# Altium schematic sheet 高压开关电源.SchDoc
size A3
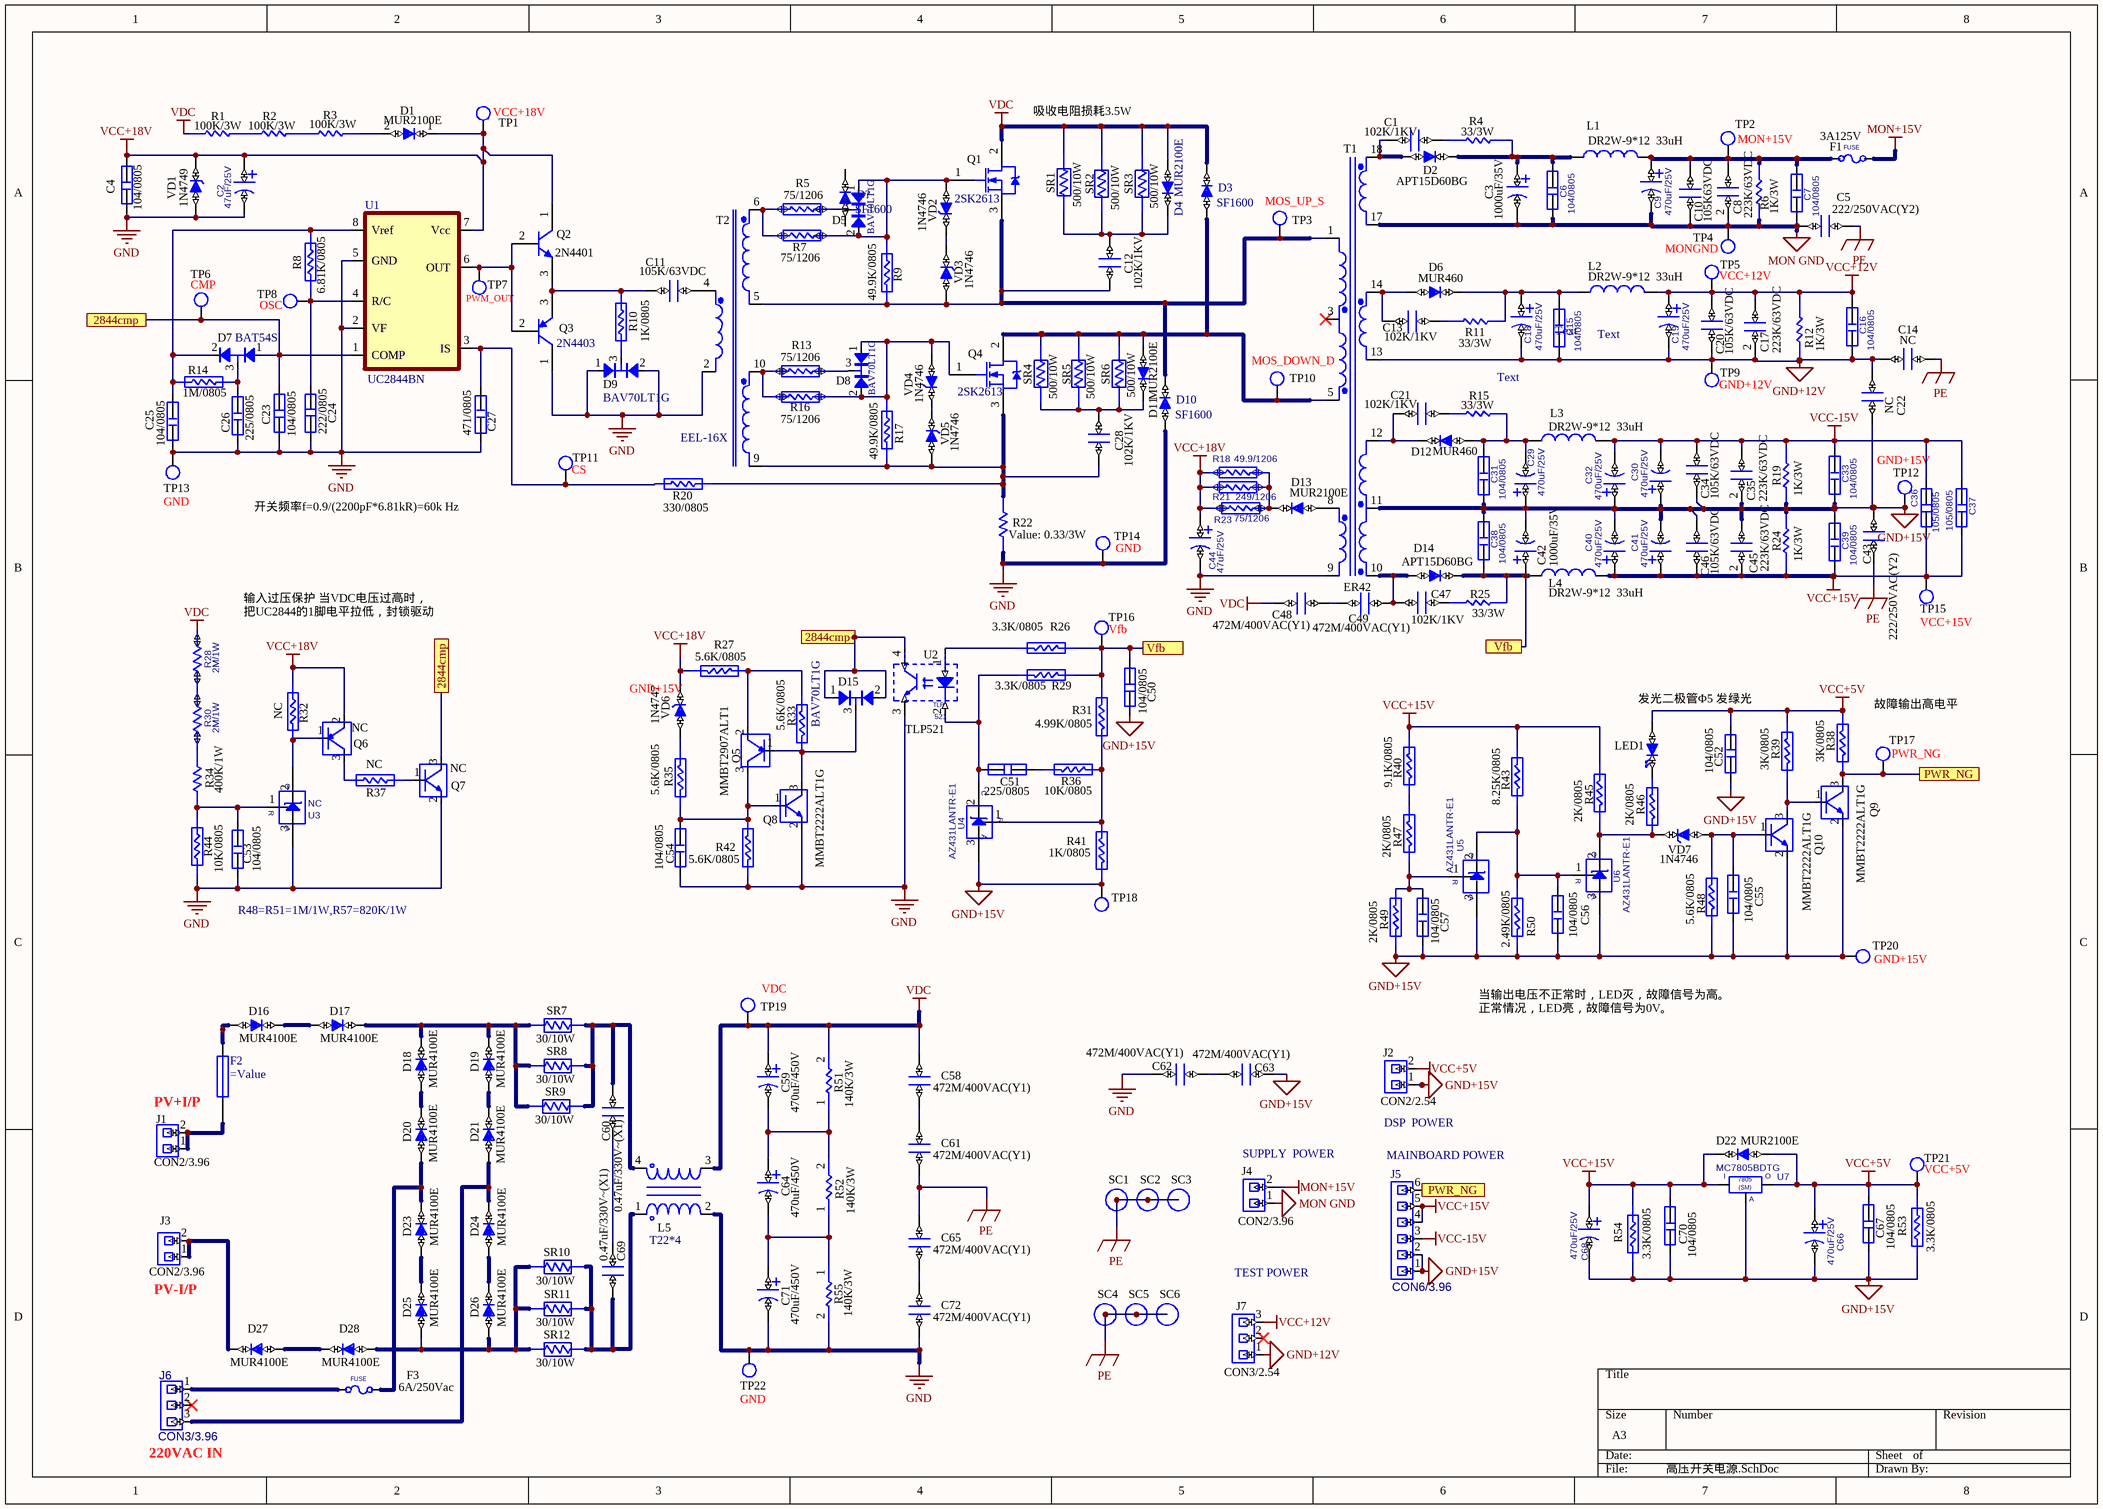
[diagram p0: 高压开关电源.SchDoc]

## Parts
C1  102K/1KV  [CC509*5]
C2  47uF/25V  [CE2050]
C3  1000uF/35V  [CE50130]
C4  104/0805  [C0805BSM]
C5  222/250VAC(Y2)  [C10013*4]
C6  104/0805  [C0805BSM]
C7  104/0805  [C0805BSM]
C8  223K/63VDC  [C508*3]
C9  470uF/25V  [CE3580]
C10  105K63VDC  [C508*5]
C11  105K/63VDC  [C508*5]
C12  102K/1KV  [CC509*5]
C13  102K/1KV  [CC509*5]
C14  NC  [C10013*4]
C15  104/0805  [C0805BSM]
C16  104/0805  [C0805BSM]
C17  223K/63VDC  [C508*3]
C18  470uF/25V  [CE3580]
C19  470uF/25V  [CE3580]
C20  105K/63VDC  [C508*5]
C21  102K/1KV  [CC509*5]
C22  NC  [C10013*4]
C23  104/0805  [C0805BSM]
C24  222/0805  [C0805BSM]
C25  104/0805  [C0805BSM]
C26  225/0805  [C0805BSM]
C27  471/0805  [C0805BSM]
C28  102K/1KV  [CC509*5]
C29  470uF/25V  [CE3580]
C30  470uF/25V  [CE3580]
C31  104/0805  [C0805BSM]
C32  470uF/25V  [CE3580]
C33  104/0805  [C0805BSM]
C34  105K/63VDC  [C508*5]
C35  223K/63VDC  [C508*3]
C36  105/0805  [C0805BSM]
C37  105/0805  [C0805BSM]
C38  104/0805  [C0805BSM]
C39  104/0805  [C0805BSM]
C40  470uF/25V  [CE3580]
C41  470uF/25V  [CE3580]
C42  1000uF/35V  [CE50130]
C43  222/250VAC(Y2)  [C10013*4]
C44  47uF/25V  [CE2050]
C45  223K/63VDC  [C508*3]
C46  105K/63VDC  [C508*5]
C47  102K/1KV  [CC509*5]
C48  472M/400VAC(Y1)  [C10013*5]
C49  472M/400VAC(Y1)  [C10013*5]
C50  104/0805  [C0805BSM]
C51  225/0805  [C0805BSM]
C52  104/0805  [C0805BSM]
C53  104/0805  [C0805BSM]
C54  104/0805  [C0805BSM]
C55  104/0805  [C0805BSM]
C56  104/0805  [C0805BSM]
C57  104/0805  [C0805BSM]
C58  472M/400VAC(Y1)  [C10013*5]
C59  470uF/450V  [CE100350]
C60  0.47uF/330V~(X1)  [C22527*9]
C61  472M/400VAC(Y1)  [C10013*5]
C62  472M/400VAC(Y1)  [C10013*5]
C63  472M/400VAC(Y1)  [C10013*5]
C64  470uF/450V  [CE100350]
C65  472M/400VAC(Y1)  [C10013*5]
C66  470uF/25V  [CE3580]
C67  104/0805  [C0805BSM]
C68  470uF/25V  [CE3580]
C69  0.47uF/330V~(X1)  [C22527*9]
C70  104/0805  [C0805BSM]
C71  470uF/450V  [CE100350]
C72  472M/400VAC(Y1)  [C10013*5]
D1  MUR2100E  [D41P2H-1]
D2  APT15D60BG  [D247P2]
D3  SF1600  [D4236P2]
D4  MUR2100E  [D4236P2]
D5  BAV70LT1G  [TRNPNBSM]
D6  MUR460  [D27P2H-1]
D7  BAT54S  [TRNPNBSM]
D8  BAV70LT1G  [TRNPNBSM]
D9  BAV70LT1G  [TRNPNBSM]
D10  SF1600  [D4236P2]
D11  MUR2100E  [D4236P2]
D12  MUR460  [D27P2H-1]
D13  MUR2100E  [D41P2H-1]
D14  APT15D60BG  [D247P2]
D15  BAV70LT1G  [TRNPNBSM]
D16  MUR4100E  [D150]
D17  MUR4100E  [D150]
D18  MUR4100E  [D150]
D19  MUR4100E  [D150]
D20  MUR4100E  [D150]
D21  MUR4100E  [D150]
D22  MUR2100E  [D41P2H-1]
D23  MUR4100E  [D150]
D24  MUR4100E  [D150]
D25  MUR4100E  [D150]
D26  MUR4100E  [D150]
D27  MUR4100E  [D150]
D28  MUR4100E  [D150]
D?  SF1600  [D4236P2]
F1  3A125V  [Fuse 3A 125V]
F2  (no value)  [F3A1000VP4]
F3  6A/250Vac  [FUSE5A350VAC]
J1  CON2/3.96  [SIP-B1P2H]
J2  CON2/2.54  [SIP-B1P2]
J3  CON2/3.96  [SIP-B1P2H]
J4  CON2/3.96  [SIP-B1P2H]
J5  CON6/3.96  [SIP-B1P6H]
J6  CON3/3.96  [SIP-B1P3H]
J7  CON3/2.54  [SIP-C3P3H]
L1  DR2W-9*12  33uH  [L9P2]
L2  DR2W-9*12  33uH  [L9P2]
L3  DR2W-9*12  33uH  [L9P2]
L4  DR2W-9*12  33uH  [L9P2]
L5  T22*4  [L28*17.5P4]
LED1  发光二极管Φ5 发绿光  [LED25C]
Q1  2SK2613  [2SK2613]
Q2  2N4401  [2N4401]
Q3  2N4403  [2N4403]
Q4  2SK2613  [2SK2613]
Q5  MMBT2907ALT1  [TRPNPBSM]
Q6  NC  [TRPNPBSM]
Q7  NC  [TRNPNBSM]
Q8  MMBT2222ALT1G  [TRNPNBSM]
Q9  MMBT2222ALT1G  [TRNPNBSM]
Q10  MMBT2222ALT1G  [TRNPNBSM]
R1  100K/3W  [R100060]
R2  100K/3W  [R100060]
R3  100K/3W  [R100060]
R4  33/3W  [R100060]
R5  75/1206  [R1206NSM]
R6  1K/3W  [R100060]
R7  75/1206  [R1206NSM]
R8  6.81K/0805  [R0805BSM]
R9  49.9K/0805  [R0805BSM]
R10  1K/0805  [R0805BSM]
R11  33/3W  [R100060]
R12  1K/3W  [R100060]
R13  75/1206  [R1206NSM]
R14  1M/0805  [R0805BSM]
R15  33/3W  [R100060]
R16  75/1206  [R1206NSM]
R17  49.9K/0805  [R0805BSM]
R18  49.9/1206  [R1206NSM]
R19  1K/3W  [R100060]
R20  330/0805  [R0805BSM]
R21  249/1206  [R1206NSM]
R22  0.33/3W  [R075005]
R23  75/1206  [R1206NSM]
R24  1K/3W  [R100060]
R25  33/3W  [R100060]
R26  3.3K/0805  [R0805BSM]
R27  5.6K/0805  [R0805BSM]
R28  2M/1W  [R075005]
R29  3.3K/0805  [R0805BSM]
R30  2M/1W  [R075005]
R31  4.99K/0805  [R0805BSM]
R32  NC  [R0805BSM]
R33  5.6K/0805  [R0805BSM]
R34  400K/1W  [R075005]
R35  5.6K/0805  [R0805BSM]
R36  10K/0805  [R0805BSM]
R37  NC  [R0805BSM]
R38  3K/0805  [R0805BSM]
R39  3K/0805  [R0805BSM]
R40  9.1K/0805  [R0805BSM]
R41  1K/0805  [R0805BSM]
R42  5.6K/0805  [R0805BSM]
R43  8.25K/0805  [R0805BSM]
R44  10K/0805  [R0805BSM]
R45  2K/0805  [R0805BSM]
R46  2K/0805  [R0805BSM]
R47  2K/0805  [R0805BSM]
R48  5.6K/0805  [R0805BSM]
R49  2K/0805  [R0805BSM]
R50  2.49K/0805  [R0805BSM]
R51  140K/3W  [R100060]
R52  140K/3W  [R100060]
R53  3.3K/0805  [R0805BSM]
R54  3.3K/0805  [R0805BSM]
R55  140K/3W  [R100060]
SC1  *  [SC40]  (value not drawn)
SC2  *  [SC40]  (value not drawn)
SC3  *  [SC40]  (value not drawn)
SC4  *  [SC40]  (value not drawn)
SC5  *  [SC40]  (value not drawn)
SC6  *  [SC40]  (value not drawn)
SR1  500/10W  [SRSQM1411]
SR2  500/10W  [SRSQM1411]
SR3  500/10W  [SRSQM1411]
SR4  500/10W  [SRSQM1411]
SR5  500/10W  [SRSQM1411]
SR6  500/10W  [SRSQM1411]
SR7  30/10W  [SRSQM130100]
SR8  30/10W  [SRSQM130100]
SR9  30/10W  [SRSQM130100]
SR10  30/10W  [SRSQM130100]
SR11  30/10W  [SRSQM130100]
SR12  30/10W  [SRSQM130100]
T1  ER42  [ER42]
T2  EEL-16X  [EEL-16X]
TP1  VCC+18V  [TEST]
TP2  MON+15V  [TEST]
TP3  MOS_UP_S  [TEST]
TP4  MONGND  [TEST]
TP5  VCC+12V  [TEST]
TP6  CMP  [TEST]
TP7  PWM_OUT  [TEST]
TP8  OSC  [TEST]
TP9  GND+12V  [TEST]
TP10  MOS_DOWN_D  [TEST]
TP11  CS  [TEST]
TP12  GND+15V  [TEST]
TP13  GND  [TEST]
TP14  GND  [TEST]
TP15  VCC+15V  [TEST]
TP16  Vfb  [TEST]
TP17  PWR_NG  [TEST]
TP18  GND+15V  [TEST]
TP19  VDC  [TEST]
TP20  GND+15V  [TEST]
TP21  VCC+5V  [TEST]
TP22  GND  [TEST]
U1  UC2844BN  [2844]
U2  TLP521  [PH521]
U3  NC  [AZ431LS23TSM]
U4  AZ431LANTR-E1  [AZ431LS23TSM]
U5  AZ431LANTR-E1  [AZ431LS23TSM]
U6  AZ431LANTR-E1  [AZ431LS23TSM]
U7  MC7805BDTG  [7805SM]
VD1  1N4749  [D41P2H-1]
VD2  1N4746  [D41P2H-1]
VD3  1N4746  [D41P2H-1]
VD4  1N4746  [D41P2H-1]
VD5  1N4746  [D41P2H-1]
VD6  1N4747  [D41P2H-1]
VD7  1N4746  [D41P2H-1]

## Ports
2844cmp, PWR_NG, Vfb

## Nets
GND: C2.2 C4.1 C23.1 C24.2 C25.1 C26.1 C27.2 C44.2 C53.1 C54.1 C62.1 C71.2 C72.2 D9.1(A1) D9.2(A2) D10.2 L5.2 Q3.1(C) Q7.2 Q8.2 R22.2 R42.2 R44.2 R55.2 T1.9 T2.2(Pri-) TP13.1 TP14.1 TP22.1 U1.2(VF) U1.5(GND) U2.3 U3.3 VD1.2
GND+12V: C14.1 C15.1 C16.1 C17.2 C18.2 C19.2 C20.2 C22.1 J7.1 R12.1 T1.13 TP9.1
GND+15V: C22.2 C29.1 C30.1 C31.1 C32.1 C33.1 C34.2 C35.2 C38.2 C39.2 C40.2 C41.2 C42.2 C43.2 C45.1 C46.1 C50.1 C52.2 C55.1 C56.1 C57.1 C63.2 C66.2 C67.1 C68.2 C70.1 J2.1 J5.1 J5.2 Q9.2 Q10.2 R19.1 R24.2 R41.2 R48.2 R49.2 R50.2 R53.2 R54.2 T1.11 TP12.1 TP18.1 TP20.1 U4.3 U5.3 U6.3 U7.2(GND)
MON GND: C3.2 C5.1 C6.1 C7.1 C8.2 C9.2 C10.2 J4.1 R6.1 T1.17 TP4.1
MON+15V: F1.2 J4.2
PE: C5.2 C14.2 C43.1 C61.2 C65.1 SC1.1 SC2.1 SC3.1 SC4.1 SC5.1 SC6.1
VCC+5V: C52.1 C66.1 C67.2 D22.2 J2.2 LED1.2 R38.1 R39.1 R53.1 TP21.1 U7.3
VCC+12V: C16.2 C17.1 C19.1 C20.1 J7.3 L2.2 R12.2 TP5.1
VCC+15V: C36.1 C37.1 C39.1 C40.1 C41.1 C45.2 C46.2 C68.1 C70.2 D22.1 J5.4 J5.5 L4.2 R24.1 R40.1 R43.1 R45.1 R54.1 TP15.1 U7.1
VCC+18V: C2.1 C4.2 C44.1 D1.1 Q2.1(C) Q6.2 R18.1 R21.1 R23.1 R27.2 R32.1 TP1.1 U1.7(Vcc) VD1.1 VD6.1
VCC-15V: C30.2 C32.2 C33.2 C34.1 C35.1 C36.2 C37.2 J5.3 L3.2 R19.2
VDC: C48.1 C58.1 C59.1 D3.1 D4.2 L5.3 Q1.2(D) R1.1 R28.1 R51.2 SR1.2 SR2.2 SR3.2 TP19.1
2844cmp: C23.2 D7.1(A2) D15.1(A1) D15.2(A2) Q7.3 TP6.1 U1.1(COMP) U2.4 ; port 2844cmp
PWR_NG: J5.6 Q9.3 R38.2 TP17.1 ; port PWR_NG
Vfb: C38.1 C42.1 C50.2 D14.1 L4.1 R25.1 R26.1 R29.1 R31.1 TP16.1 ; port Vfb
NetC1_1: C1.1 D2.2 T1.18
NetC1_2: C1.2 R4.1
NetC3_1: C3.1 C6.2 D2.1 L1.1 R4.2
NetC7_2: C7.2 C8.1 C9.1 C10.1 F1.1 L1.2 R6.2 TP2.1
NetC11_1: C11.1 T2.4(Pri+)
NetC11_2: C11.2 Q2.3(E) Q3.3(E) R10.1
NetC12_1: C12.1 D10.1 Q1.3(S) R9.2 T1.1 T2.5 TP3.1 VD3.2
NetC12_2: C12.2 D4.1 SR1.1 SR2.1 SR3.1
NetC13_1: C13.1 D6.2 T1.14
NetC13_2: C13.2 R11.1
NetC15_2: C15.2 C18.1 D6.1 L2.1 R11.2
NetC21_1: C21.1 D12.1 T1.12
NetC21_2: C21.2 R15.2
NetC24_1: C24.1 R8.2 TP8.1 U1.4(R/C)
NetC25_2: C25.2 D7.2(A1) R8.1 R14.2 U1.8(Vref)
NetC26_2: C26.2 D7.3(K) R14.1
NetC27_1: C27.1 R20.1 TP11.1 U1.3(IS)
NetC28_1: C28.1 Q4.3(S) R17.2 R20.2 R22.1 T2.9 VD5.2
NetC28_2: C28.2 D11.1 SR4.1 SR5.1 SR6.1
NetC29_2: C29.2 C31.2 D12.2 L3.1 R15.1
NetC47_1: C47.1 C49.2 D14.2 T1.10
NetC47_2: C47.2 R25.2
NetC48_2: C48.2 C49.1
NetC51_1: C51.1 R36.2
NetC51_2: C51.2 R29.2 U2.2 U4.2
NetC53_2: C53.2 R34.2 R44.1 U3.1
NetC54_2: C54.2 Q5.3 Q8.1 R35.2 R42.1
NetC55_2: C55.2 Q10.1 R48.1 VD7.2
NetC56_2: C56.2 R43.2 R50.1 U5.2 U6.1
NetC57_2: C57.2 R47.2 R49.1 U5.1
NetC58_2: C58.2 C61.1
NetC59_2: C59.2 C64.1 R51.1 R52.2
NetC60_1: C60.1 L5.4 SR7.2 SR8.2 SR9.2
NetC60_2: C60.2 C69.1
NetC62_2: C62.2 C63.1
NetC64_2: C64.2 C71.1 R52.1 R55.1
NetC65_2: C65.2 C72.1
NetC69_2: C69.2 L5.1 SR10.2 SR11.2 SR12.2
NetD1_2: D1.2 R3.2
NetD3_2: D3.2 D11.2 Q4.2(D) SR4.2 SR5.2 SR6.2 T1.5 TP10.1
NetD5_1: D5.1(A1) D5.2(A2) Q1.1(G) R7.2 R9.1 VD2.2
NetD5_3: D5.3(K) R5.2
NetD8_1: D8.1(A1) D8.2(A2) Q4.1(G) R16.2 R17.1 VD4.2
NetD8_3: D8.3(K) R13.2
NetD9_3: D9.3(K) R10.2
NetD13_1: D13.1 R18.2 R21.2 R23.2
NetD13_2: D13.2 T1.8
NetD15_3: D15.3(K) Q5.1 Q8.3 R33.2
NetD16_1: D16.1 F2.3 F2.4
NetD16_2: D16.2 D17.1
NetD17_2: D17.2 D18.2 D19.2 SR7.1 SR8.1 SR9.1
NetD18_1: D18.1 D20.2
NetD19_1: D19.1 D21.2
NetD20_1: D20.1 D23.2 F3.2
NetD21_1: D21.1 D24.2 J6.3
NetD23_1: D23.1 D25.2
NetD24_1: D24.1 D26.2
NetD25_1: D25.1 D26.1 D28.1 SR10.1 SR11.1 SR12.1
NetD27_1: D27.1 D28.2
NetD27_2: D27.2 J3.1 J3.2
NetF2_1: F2.1 J1.1 J1.2
NetF3_1: F3.1 J6.1
NetLED1_1: LED1.1 R46.1
NetQ2_2: Q2.2(B) Q3.2(B) TP7.1 U1.6(OUT)
NetQ5_2: Q5.2 R27.1 R33.1
NetQ6_1: Q6.1 R32.2 U3.2
NetQ6_3: Q6.3 R37.1
NetQ7_1: Q7.1 R37.2
NetQ9_1: Q9.1 Q10.3 R39.2
NetR1_2: R1.2 R2.2
NetR2_1: R2.1 R3.1
NetR5_1: R5.1 R7.1 T2.6
NetR13_1: R13.1 R16.1 T2.10
NetR26_2: R26.2 U2.1
NetR28_2: R28.2 R30.2
NetR30_1: R30.1 R34.1
NetR31_2: R31.2 R36.1 R41.1 U4.1
NetR35_1: R35.1 VD6.2
NetR40_2: R40.2 R47.1
NetR45_2: R45.2 R46.2 U6.2 VD7.1
NetVD2_1: VD2.1 VD3.1
NetVD4_1: VD4.1 VD5.1

Not connected (* = marked no-connect by the designer): D? 1 2; F2 2; J6 2*; J7 2*; T1 3*

## Notes on the sheet
- 吸收电阻损耗3.5W
- Text
- (near C15) Text
- 开关频率f=0.9/(2200pF*6.81kR)=60k Hz
- 输入过压保护 当VDC电压过高时，
  把UC2844的1脚电平拉低，封锁驱动
- 故障输出高电平
- R48=R51=1M/1W,R57=820K/1W
- 当输出电压不正常时，LED灭，故障信号为高。
  正常情况，LED亮，故障信号为0V。
- PV+I/P
- (near J2) DSP  POWER
- (near J4) SUPPLY  POWER
- (near J5) MAINBOARD POWER
- (near J3) PV-I/P
- TEST POWER
- (near J6) 220VAC IN
- (in symbol 7805SM) I; O; 7805; (SM); A
- (in symbol AZ431LS23TSM) C; R; A
- (in symbol PH521) TLP; 521

## Library data of the parts
C1 C12 C13 C21 C28 C47 = CC509*5: Value: 102K/1KV
C2 C44 = CE2050: Value: 47uF/25V
C3 C42 = CE50130: Value: 1000uF/35V
C4 C6 C7 C15 C16 C23-C27 C31 C33 C36-C39 C50-C57 C67 C70 = C0805BSM
  C4 C6 C7 C15 C16 C23 C25 C31 C33 C38 C39 C50 C52-C57 C67 C70: Value: 104/0805
  C24: Value: 222/0805
  C26 C51: Value: 225/0805
  C27: Value: 471/0805
  C36 C37: Value: 105/0805
C5 C14 C22 C43 = C10013*4
  C5 C43: Value: 222/250VAC(Y2)
  C14 C22: Value: NC
C8 C17 C35 C45 = C508*3: Value: 223K/63VDC
C9 C18 C19 C29 C30 C32 C40 C41 C66 C68 = CE3580: Value: 470uF/25V
C10 C11 C20 C34 C46 = C508*5
  C10: Value: 105K63VDC
  C11 C20 C34 C46: Value: 105K/63VDC
C48 C49 C58 C61-C63 C65 C72 = C10013*5: Value: 472M/400VAC(Y1)
C59 C64 C71 = CE100350: Value: 470uF/450V
C60 C69 = C22527*9: Value: 0.47uF/330V~(X1)
D1 D11 D13 D22 VD1-VD7 = D41P2H-1
  D1 D11 D13 D22: Value: MUR2100E
  VD1: Value: 1N4749
  VD2-VD5 VD7: Value: 1N4746
  VD6: Value: 1N4747
D2 D14 = D247P2: Value: APT15D60BG
D3 D4 D10 D? = D4236P2
  D3 D10 D?: Value: SF1600
  D4: Value: MUR2100E
D6 D12 = D27P2H-1: Value: MUR460
D7 = MMBD4148SE: Value: BAT54S
D16-D21 D23-D28 = D150: Value: MUR4100E
F1 F3 = FUSE
  F1: Value: 3A125V
  F3: Value: 6A/250Vac
F2 = F3A1000VP4
J1-J4 = CN25P02
  J1 J3 J4: Value: CON2/3.96
  J2: Value: CON2/2.54
J5 = SIP-B1P6H: Value: CON6/3.96
J6 = SIP-B1P3H: Value: CON3/3.96
J7 = SIP-C3P3H: Value: CON3/2.54
L1-L4 = L9P2: Value: DR2W-9*12  33uH
L5 = L28*17.5P4: Value: T22*4
LED1 = LED25C: Value: 发光二极管Φ5 发绿光
Q5 Q6 = TRPNPBSM
  Q5: Value: MMBT2907ALT1
  Q6: Value: NC
Q7-Q10 = TRNPNBSM
  Q7: Value: NC
  Q8-Q10: Value: MMBT2222ALT1G
R1-R4 R6 R11 R12 R15 R19 R24 R25 R51 R52 R55 = R100060
  R1-R3: Value: 100K/3W
  R4 R11 R15 R25: Value: 33/3W
  R6 R12 R19 R24: Value: 1K/3W
  R51 R52 R55: Value: 140K/3W
R5 R7 R13 R16 R18 R21 R23 = R1206NSM
  R5 R7 R13 R16 R23: Value: 75/1206
  R18: Value: 49.9/1206
  R21: Value: 249/1206
R8-R10 R14 R17 R20 R26 R27 R29 R31-R33 R35-R50 R53 R54 = R0805BSM
  R8: Value: 6.81K/0805
  R9 R17: Value: 49.9K/0805
  R10 R41: Value: 1K/0805
  R14: Value: 1M/0805
  R20: Value: 330/0805
  R26 R29 R53 R54: Value: 3.3K/0805
  R27 R33 R35 R42 R48: Value: 5.6K/0805
  R31: Value: 4.99K/0805
  R32 R37: Value: NC
  R36 R44: Value: 10K/0805
  R38 R39: Value: 3K/0805
  R40: Value: 9.1K/0805
  R43: Value: 8.25K/0805
  R45-R47 R49: Value: 2K/0805
  R50: Value: 2.49K/0805
R22 R28 R30 R34 = R075005
  R22: Value: 0.33/3W
  R28 R30: Value: 2M/1W
  R34: Value: 400K/1W
SC1-SC6 = SC40: PDIF_TY: 255; Value: *
SR1-SR12 = SRSQM200100
  SR1-SR6: Value: 500/10W
  SR7-SR12: Value: 30/10W
TP1-TP22 = TEST
  TP1: Value: VCC+18V
  TP2: Value: MON+15V
  TP3: Value: MOS_UP_S
  TP4: Value: MONGND
  TP5: Value: VCC+12V
  TP6: Value: CMP
  TP7: Value: PWM_OUT
  TP8: Value: OSC
  TP9: Value: GND+12V
  TP10: Value: MOS_DOWN_D
  TP11: Value: CS
  TP12 TP18 TP20: Value: GND+15V
  TP13 TP14 TP22: Value: GND
  TP15: Value: VCC+15V
  TP16: Value: Vfb
  TP17: Value: PWR_NG
  TP19: Value: VDC
  TP21: Value: VCC+5V
U2 = PH521: Value: TLP521
U3-U6 = AZ431LS23TSM
  U3: Value: NC
  U4-U6: Value: AZ431LANTR-E1
U7 = 7805SM: Value: MC7805BDTG
D5 D8 D9 D15 = BAV70LT1G: Value: BAV70LT1G
Q1 Q4 = 2sk2613: Value: 2SK2613
Q2 = 2N4401: Value: 2N4401
Q3 = 2N4403: Value: 2N4403
T1 = ER42: Value: ER42
T2 = EEL-16X: Value: EEL-16X